# EAGLE schematic untitled (EAGLE 6.2)
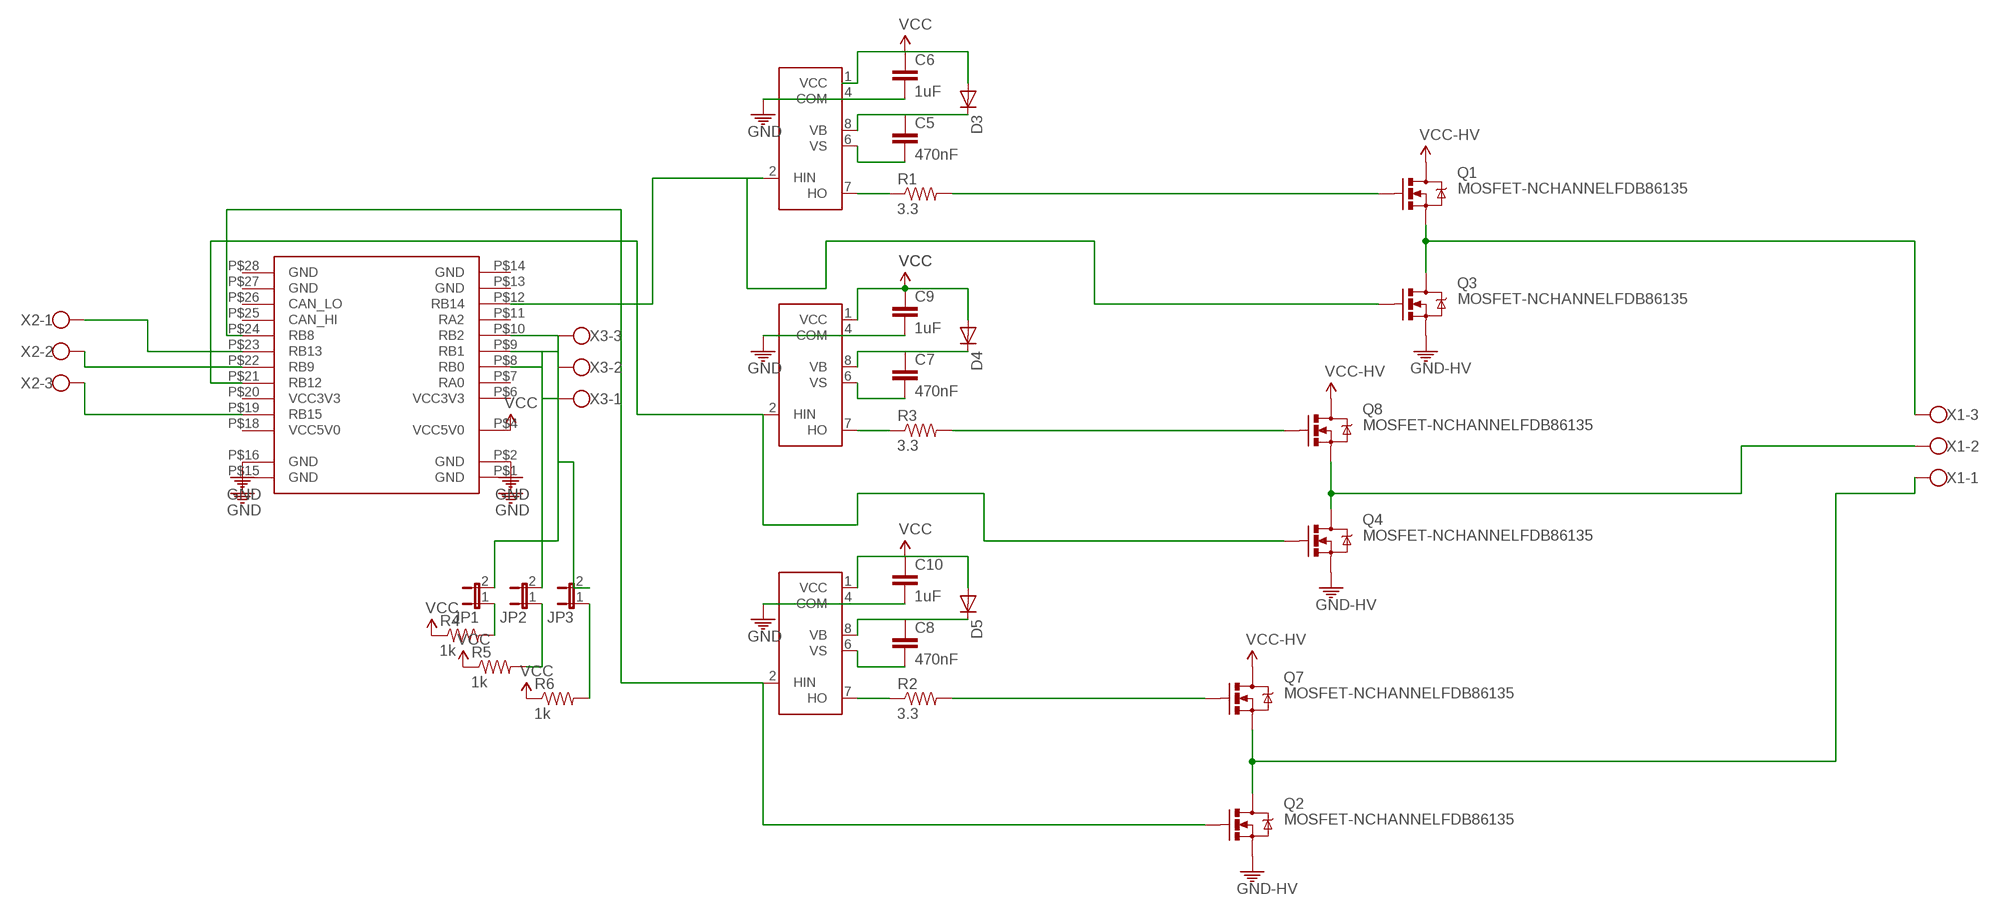
[diagram p0: schematic, sheet 1]

## Parts
C5  470nF  CAP1206  [1206]
C6  1uF  CAP1206  [1206]
C7  470nF  CAP1206  [1206]
C8  470nF  CAP1206  [1206]
C9  1uF  CAP1206  [1206]
C10  1uF  CAP1206  [1206]
D3  DIODEHV  [DIODE-HV]
D4  DIODEHV  [DIODE-HV]
D5  DIODEHV  [DIODE-HV]
JP1  JP1E  [JP1]
JP2  JP1E  [JP1]
JP3  JP1E  [JP1]
Q1  MOSFET-NCHANNELFDB86135  MOSFET-NCHANNELFDD8580  [DPAK]
Q2  MOSFET-NCHANNELFDB86135  MOSFET-NCHANNELFDD8580  [DPAK]
Q3  MOSFET-NCHANNELFDB86135  MOSFET-NCHANNELFDD8580  [DPAK]
Q4  MOSFET-NCHANNELFDB86135  MOSFET-NCHANNELFDD8580  [DPAK]
Q7  MOSFET-NCHANNELFDB86135  MOSFET-NCHANNELFDD8580  [DPAK]
Q8  MOSFET-NCHANNELFDB86135  MOSFET-NCHANNELFDD8580  [DPAK]
R1  3.3  RESISTOR1206  [1206]
R2  3.3  RESISTOR1206  [1206]
R3  3.3  RESISTOR1206  [1206]
R4  1k  RESISTOR1206  [1206]
R5  1k  RESISTOR1206  [1206]
R6  1k  RESISTOR1206  [1206]
U$1  CAN_NODE_SHIELD  [CAN_NODE_SHIELD]
U$2  IRS21850SPBF  [SO08]
U$3  IRS21850SPBF  [SO08]
U$4  IRS21850SPBF  [SO08]
X1  W237-103  [W237-103]
X2  W237-103  [W237-103]
X3  W237-103  [W237-103]

## Nets
GND: C6.2 C9.2 C10.2 Q2.3(S) Q3.3(S) Q4.3(S) U$1.P$1(GND) U$1.P$2(GND) U$1.P$15(GND) U$1.P$16(GND) U$2.4(COM) U$3.4(COM) U$4.4(COM) ; supply symbol labelled GND-HV
N$1: R1.1 U$2.7(HO)
N$2: Q3.1(G) U$1.P$12(RB14) U$2.2(HIN)
N$3: Q1.1(G) R1.2
N$4: Q4.1(G) U$1.P$21(RB12) U$3.2(HIN)
N$5: C5.1 D3.C U$2.8(VB)
N$6: C5.2 U$2.6(VS)
N$7: Q2.1(G) U$1.P$24(RB8) U$4.2(HIN)
N$8: Q1.3(S) Q3.4(D) X1.3
N$9: C7.1 D4.C U$3.8(VB)
N$10: C7.2 U$3.6(VS)
N$11: Q4.4(D) Q8.3(S) X1.2
N$12: C8.1 D5.C U$4.8(VB)
N$13: C8.2 U$4.6(VS)
N$14: R2.1 U$4.7(HO)
N$15: Q7.1(G) R2.2
N$16: R3.1 U$3.7(HO)
N$17: Q8.1(G) R3.2
N$18: Q2.4(D) Q7.3(S) X1.1
N$19: U$1.P$23(RB13) X2.1
N$20: U$1.P$19(RB15) X2.3
N$21: U$1.P$22(RB9) X2.2
N$22: JP3.2 U$1.P$8(RB0) X3.1
N$23: JP2.2 U$1.P$9(RB1) X3.2
N$24: JP1.2 U$1.P$10(RB2) X3.3
N$26: JP1.1 R4.2
N$27: JP2.1 R5.2
N$28: JP3.1 R6.2
VCC: C6.1 C9.1 C10.1 D3.A D4.A D5.A Q1.4(D) Q7.4(D) Q8.4(D) R4.1 R5.1 R6.1 U$1.P$4(VCC5V0) U$3.1(VCC) U$4.1(VCC) ; supply symbol labelled VCC-HV
Unconnected: U$1.P$6(VCC3V3) U$1.P$7(RA0) U$1.P$11(RA2) U$1.P$13(GND) U$1.P$14(GND) U$1.P$18(VCC5V0) U$1.P$20(VCC3V3) U$1.P$25(CAN_HI) U$1.P$26(CAN_LO) U$1.P$27(GND) U$1.P$28(GND) U$2.1(VCC)

## Library data of the parts
C5-C10 = CMPE118lib:CAP: Capacitor Standard 0603 ceramic capacitor, and 0.1" leaded capacitor.
D3-D5 = CMPE118lib:DIODE: Diode These are standard reverse protection diodes and small signal diodes. SMA package can handle up to about 1A. SOD-323 can handle about 200mA. What the SOD-323 package when ordering, there are some mfgs out there that are 5-pin packages.
JP1-JP3 = jumper:JP1E: JUMPER
Q1-Q4 Q7 Q8 = SparkFun-DiscreteSemi:MOSFET-NCHANNEL: Generic NMOS footprint
R1-R6 = CMPE118lib:RESISTOR: Resistor Basic schematic elements and footprints for 0603, 1206, and PTH resistors.
U$1 = CMPE118lib:CAN_NODE_SHIELD: A shield part for the dsPIC33f CAN node.
U$2-U$4 = CMPE118lib:IRS21850SPBF
X1-X3 = con-wago-500:W237-103: WAGO SCREW CLAMP; MPN: 237-103; OC_FARNELL: unknown; OC_NEWARK: 18M7116